# Altium schematic sheet Sheet2.SCHDOC
size 593 x 439 mm; DocumentNumber: ЕМС.02.00.200 Э3; SheetNumber: 2; SheetTotal: 4; DocumentName: Sheet2.SCHDOC
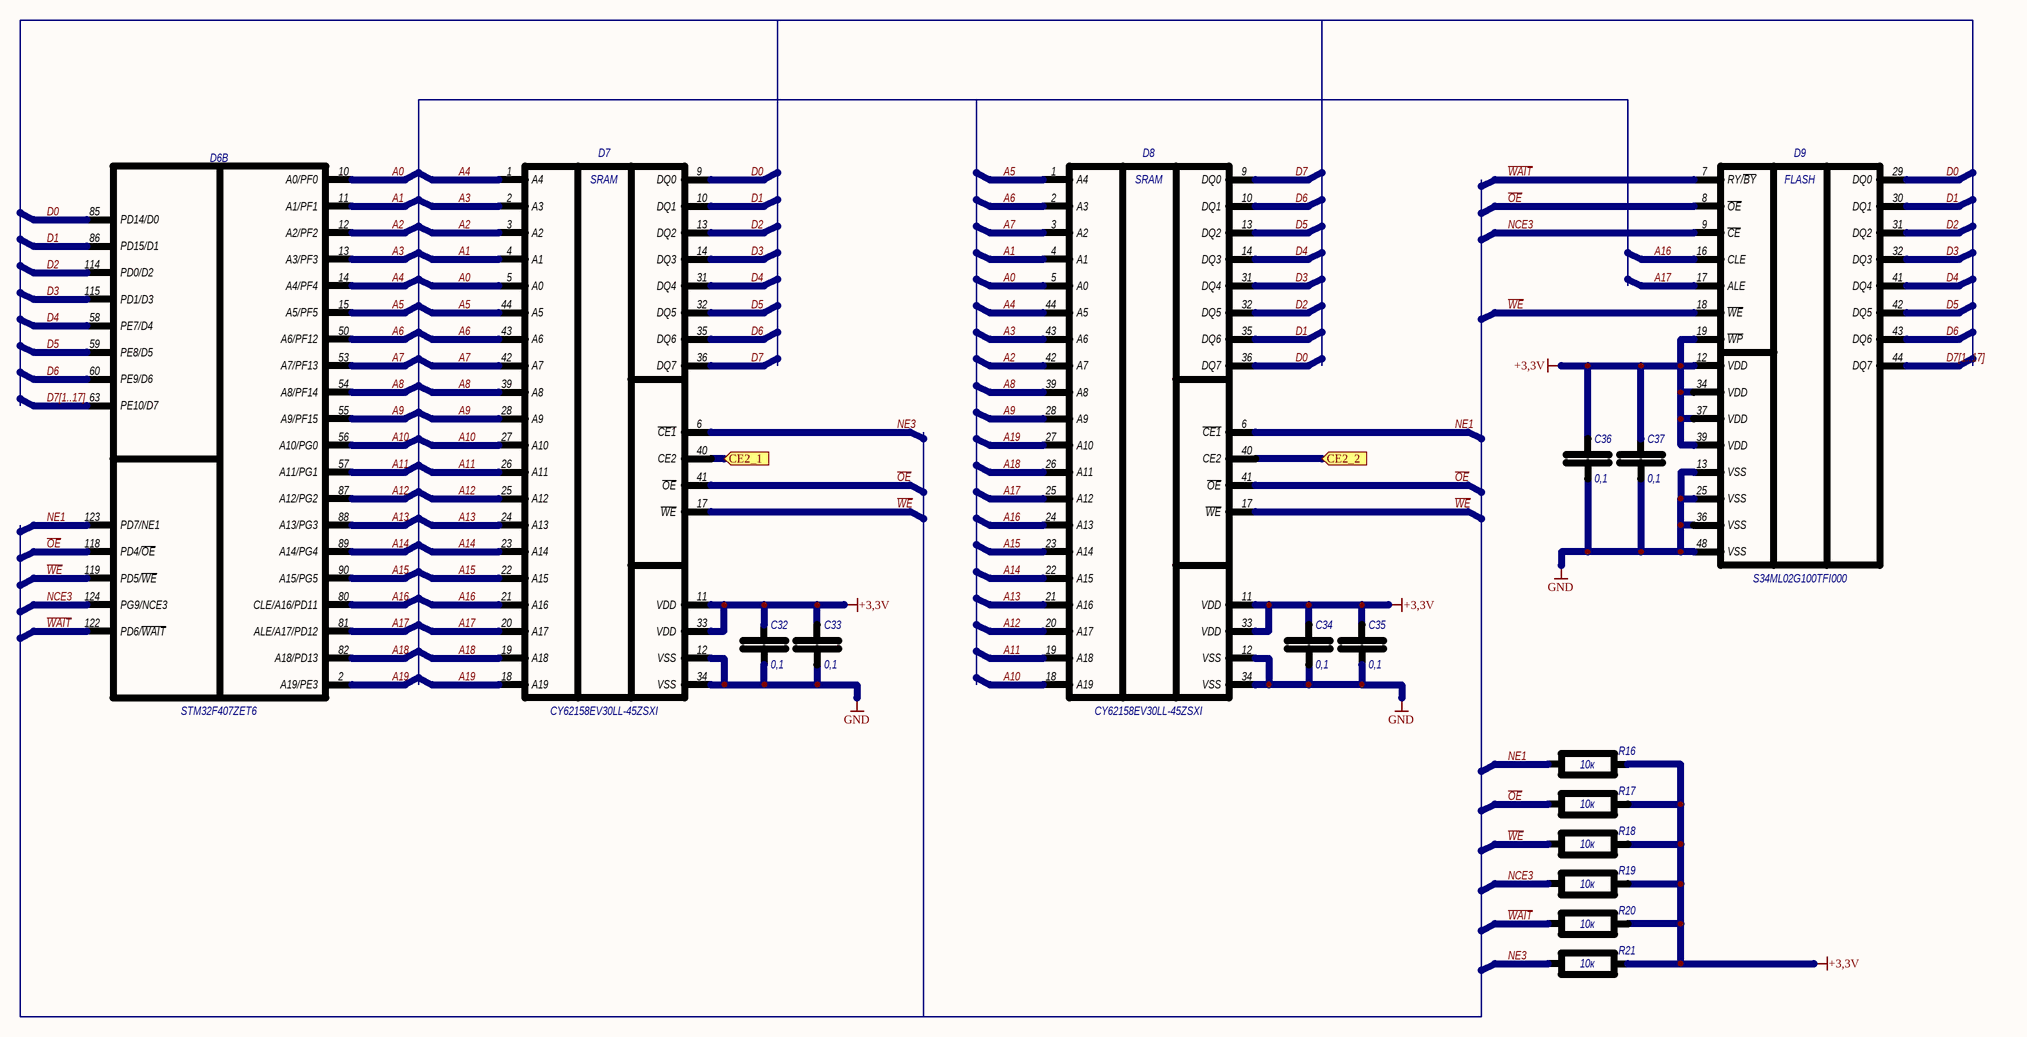
[diagram p0: Sheet2.SCHDOC]

## Parts
C32  value 0,1  [0805]  (hidden comment: К0805)
C33  value 0,1  [0805]  (hidden comment: К0805)
C34  value 0,1  [0805]  (hidden comment: К0805)
C35  value 0,1  [0805]  (hidden comment: К0805)
C36  value 0,1  [0805]  (hidden comment: К0805)
C37  value 0,1  [0805]  (hidden comment: К0805)
D6  STM32F407ZET6  [LQFP-144]  (part B of 4)
D7  CY62158EV30LL-45ZSXI  [TSOP-44]
D8  CY62158EV30LL-45ZSXI  [TSOP-44]
D9  S34ML02G100TFI000  [TSSOP2-48]
R16  Р0805  [0805]  (value not drawn)
R17  Р0805  [0805]  (value not drawn)
R18  Р0805  [0805]  (value not drawn)
R19  Р0805  [0805]  (value not drawn)
R20  Р0805  [0805]  (value not drawn)
R21  Р0805  [0805]  (value not drawn)

## Ports
CE2_1 (in), CE2_2 (in)

## Nets
+3,3V: C32.2 C33.2 C34.2 C35.2 C36.2 C37.2 D7.11(VDD) D7.33(VDD) D8.11(VDD) D8.33(VDD) D9.12(VDD) D9.19(~{WP}) D9.34(VDD) D9.37(VDD) D9.39(VDD) R16.1 R17.1 R18.1 R19.1 R20.1 R21.1
GND: C32.1 C33.1 C34.1 C35.1 C36.1 C37.1 D7.12(VSS) D7.34(VSS) D8.12(VSS) D8.34(VSS) D9.13(VSS) D9.25(VSS) D9.36(VSS) D9.48(VSS)
A0: D6.10(A0/PF0) D7.5(A0) D8.5(A0)
A1: D6.11(A1/PF1) D7.4(A1) D8.4(A1)
A2: D6.12(A2/PF2) D7.3(A2) D8.42(A7)
A3: D6.13(A3/PF3) D7.2(A3) D8.43(A6)
A4: D6.14(A4/PF4) D7.1(A4) D8.44(A5)
A5: D6.15(A5/PF5) D7.44(A5) D8.1(A4)
A6: D6.50(A6/PF12) D7.43(A6) D8.2(A3)
A7: D6.53(A7/PF13) D7.42(A7) D8.3(A2)
A8: D6.54(A8/PF14) D7.39(A8) D8.39(A8)
A9: D6.55(A9/PF15) D7.28(A9) D8.28(A9)
A10: D6.56(A10/PG0) D7.27(A10) D8.18(A19)
A11: D6.57(A11/PG1) D7.26(A11) D8.19(A18)
A12: D6.87(A12/PG2) D7.25(A12) D8.20(A17)
A13: D6.88(A13/PG3) D7.24(A13) D8.21(A16)
A14: D6.89(A14/PG4) D7.23(A14) D8.22(A15)
A15: D6.90(A15/PG5) D7.22(A15) D8.23(A14)
A16: D6.80(CLE/A16/PD11) D7.21(A16) D8.24(A13) D9.16(CLE)
A17: D6.81(ALE/A17/PD12) D7.20(A17) D8.25(A12) D9.17(ALE)
A18: D6.82(A18/PD13) D7.19(A18) D8.26(A11)
A19: D6.2(A19/PE3) D7.18(A19) D8.27(A10)
CE2_1: D7.40(CE2) ; port CE2_1
CE2_2: D8.40(CE2) ; port CE2_2
D0: D6.85(PD14/D0) D7.9(DQ0) D8.36(DQ7) D9.29(DQ0)
D1: D6.86(PD15/D1) D7.10(DQ1) D8.35(DQ6) D9.30(DQ1)
D2: D6.114(PD0/D2) D7.13(DQ2) D8.32(DQ5) D9.31(DQ2)
D3: D6.115(PD1/D3) D7.14(DQ3) D8.31(DQ4) D9.32(DQ3)
D4: D6.58(PE7/D4) D7.31(DQ4) D8.14(DQ3) D9.41(DQ4)
D5: D6.59(PE8/D5) D7.32(DQ5) D8.13(DQ2) D9.42(DQ5)
D6: D6.60(PE9/D6) D7.35(DQ6) D8.10(DQ1) D9.43(DQ6)
D7: D7.36(DQ7) D8.9(DQ0)
D7[1..17]: D6.63(PE10/D7) D9.44(DQ7)
NCE3: D6.124(PG9/NCE3) D9.9(~{CE}) R19.2
NE1: D6.123(PD7/NE1) D8.6(~{CE1}) R16.2
NE3: D7.6(~{CE1}) R21.2
~{OE}: D6.118(PD4/~{OE}) D7.41(~{OE}) D8.41(~{OE}) D9.8(~{OE}) R17.2
~{WAIT}: D6.122(PD6/~{WAIT}) D9.7(RY/~{BY}) R20.2
~{WE}: D6.119(PD5/~{WE}) D7.17(~{WE}) D8.17(~{WE}) D9.18(~{WE}) R18.2

Not connected (* = marked no-connect by the designer): D6 49; D7 7 8 15 16 29 30 37 38; D8 7 8 15 16 29 30 37 38; D9 1 2 3 4 5 6 10 11 14 15 20 21 22 23 24 26 27 28 33 35 38 40 45 46 47

## Notes on the sheet
- Подп. и дата
- Инв. № дубл.
- Взам. инв. №
- Инв. № подл.
- Лист
- Изм.
- № докум.
- Подп.
- Дата
- (in symbol CY62158EV30LL-45ZSXI) SRAM
- (in symbol S34ML02G100TFI000) FLASH
- (in symbol Р0805) 10к

## Library data of the parts
C32-C37 = К0805: КОНДЕНСАТОР; TG: NP0; TO: 5%; TU: {TU}; NO: {NO}; RefDes2: {RefDes2}; ComponentHeight: 1
R16-R21 = Р0805: РЕЗИСТОР; TG: 0,125; TO: 1%; TU: {TU}; NO: {NO}; RefDes2: {RefDes2}; ComponentHeight: 1